# Altium schematic sheet MCU.SchDoc
size A4; SheetNumber: 2; SheetTotal: 6
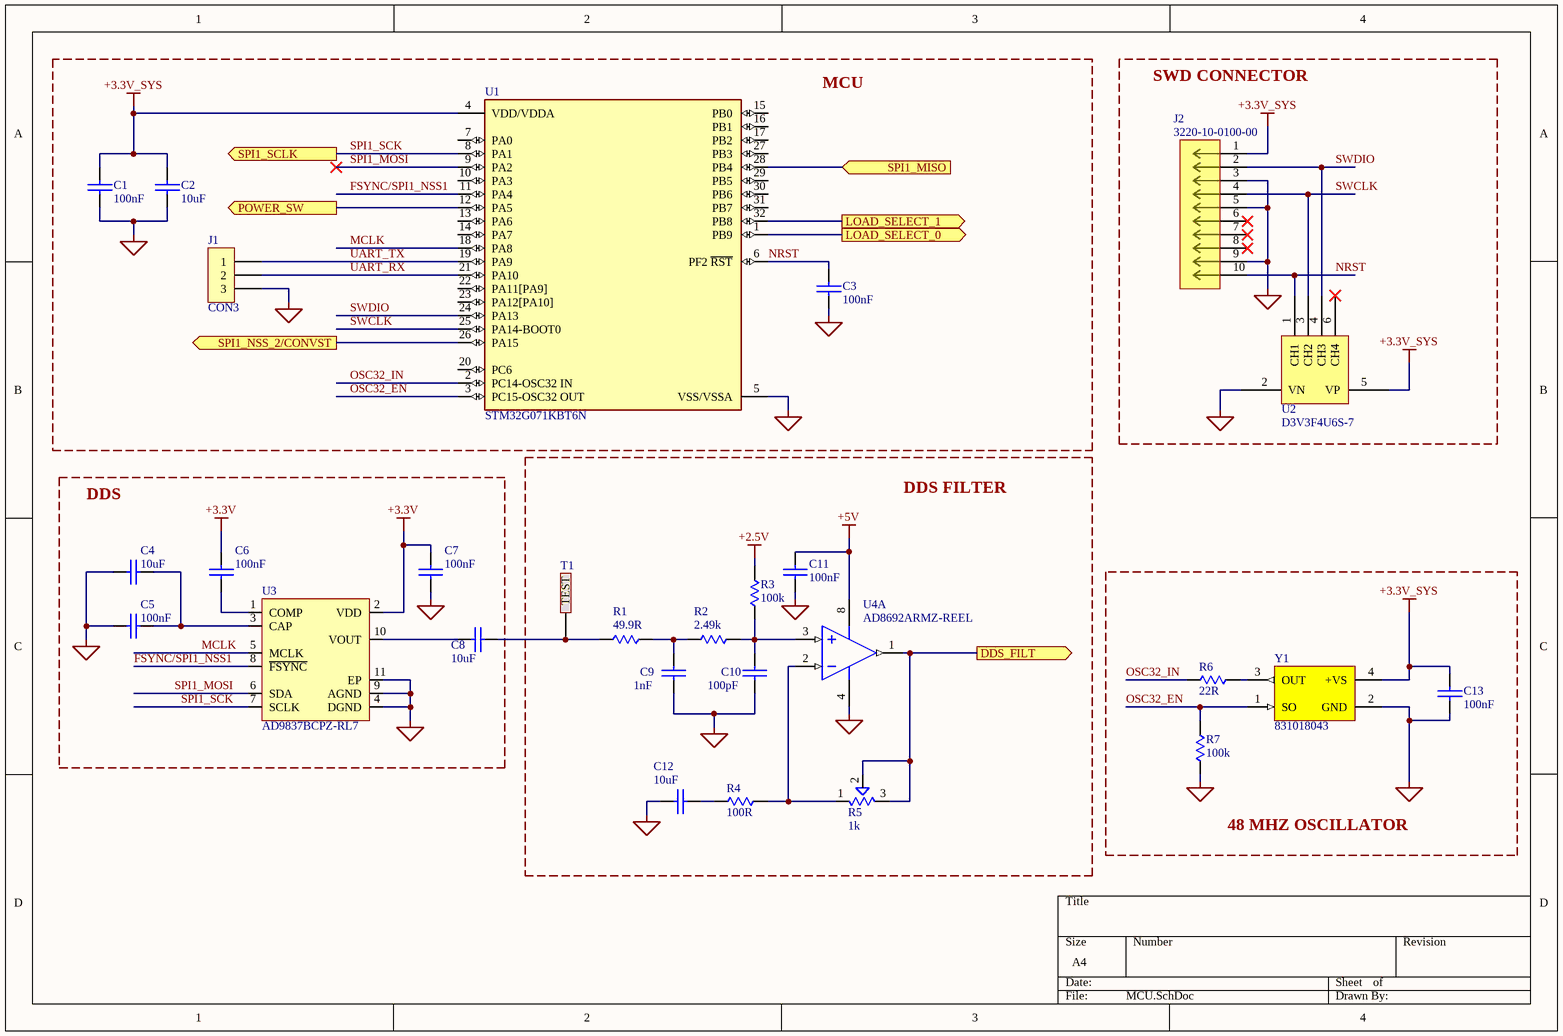
[diagram p0: MCU.SchDoc]

## Parts
C1  100nF  [0603-CAP]
C2  10uF  [0603-CAP]
C3  100nF  [0603-CAP]
C4  10uF  [0603-CAP]
C5  100nF  [0603-CAP]
C6  100nF  [0603-CAP]
C7  100nF  [0603-CAP]
C8  10uF  [0603-CAP]
C9  1nF  [0603-CAP]
C10  100pF  [0603-CAP]
C11  100nF  [0603-CAP]
C12  10uF  [0603-CAP]
C13  100nF  [0603-CAP]
J1  CON3  [SIP3]
J2  3220-10-0100-00  [CONN_3220-10-0100-00_CNC]
R1  49.9R  [0603-RES]
R2  2.49k  [0603-RES]
R3  100k  [0603-RES]
R4  100R  [0603-RES]
R5  1k  [TRIM_PVG5A102C03R00]
R6  22R  [0603-RES]
R7  100k  [0603-RES]
T1  5002K  [TESTPOINT White]  (value not drawn)
U1  STM32G071KBT6N  [FP-LQFP32-5V-IPC_C]
U2  D3V3F4U6S-7  [SOT-363_DIO]
U3  AD9837BCPZ-RL7  [LFCSP-WD (3x3) - 10 Pin EPAD]
U4  AD8692ARMZ-REEL  [ADI-RM-8_M]  (part A of 2)
Y1  831018043  [WE-SPXO_CFPS-73]

## Blocks framed on the sheet
MCU: C1-C3 J1 U1
SWD CONNECTOR: J2 U2
DDS FILTER: C9-C12 R1-R5 T1 U4
DDS: C4-C8 U3
48 MHZ OSCILLATOR: C13 R6 R7 Y1

## Ports
DDS_FILT (out, see BLOCK DIAGRAM[2B], MEHCP[1A]), LOAD_SELECT_0 (out, see BLOCK DIAGRAM[2B], LOADS[3C]), LOAD_SELECT_1 (out, see BLOCK DIAGRAM[2B], LOADS[4C]), POWER_SW (out, see BLOCK DIAGRAM[2B], POWER[3C]), SPI1_MISO (in, see BLOCK DIAGRAM[2B], SENSE[3D]), SPI1_NSS_2/CONVST (out, see BLOCK DIAGRAM[2B], SENSE[3D]), SPI1_SCLK (out, see BLOCK DIAGRAM[2B], SENSE[3D])

## Nets
+2.5V: R3.2
+3.3V: C6.1 C7.1 U3.2(VDD)
+3.3V_SYS: C1.2 C2.1 C13.2 J2.1 U1.4(VDD/VDDA) U2.5(VP) Y1.4(+VS)
+5V: C11.1 U4.8(+V)
GND: C1.1 C2.2 C3.1 C4.2 C5.2 C7.2 C9.2 C10.2 C11.2 C12.2 C13.1 J1.3 J2.3 J2.5 J2.9 R7.1 U1.5(VSS/VSSA) U2.2(VN) U3.4(DGND) U3.9(AGND) U3.11(EP) U4.4(-V) Y1.2(GND)
DDS_FILT: R5.2 R5.3 U4.1(OUT_A) ; port DDS_FILT
FSYNC/SPI1_NSS1: U1.11(PA4) U3.8(~{FSYNC})
LOAD_SELECT_0: U1.1(PB9) ; port LOAD_SELECT_0
LOAD_SELECT_1: U1.32(PB8) ; port LOAD_SELECT_1
MCLK: U1.18(PA8) U3.5(MCLK)
NRST: C3.2 J2.10 U1.6(PF2_~{RST}) U2.1(CH1)
OSC32_EN: R7.2 U1.3(PC15-OSC32_OUT) Y1.1(SO)
OSC32_IN: R6.1 U1.2(PC14-OSC32_IN)
POWER_SW: U1.12(PA5) ; port POWER_SW
SPI1_MISO: U1.28(PB4) ; port SPI1_MISO
SPI1_MOSI: U1.9(PA2) U3.6(SDA)
SPI1_NSS_2/CONVST: U1.26(PA15) ; port SPI1_NSS_2/CONVST
SPI1_SCK: U1.8(PA1) U3.7(SCLK) ; port SPI1_SCLK
SWCLK: J2.4 U1.25(PA14-BOOT0) U2.3(CH2)
SWDIO: J2.2 U1.24(PA13) U2.4(CH3)
UART_RX: J1.2 U1.21(PA10)
UART_TX: J1.1 U1.19(PA9)
NetC4_1: C4.1 C5.1 U3.3(CAP)
NetC6_2: C6.2 U3.1(COMP)
NetC8_1: C8.1 R1.1 T1.1(TEST)
NetC8_2: C8.2 U3.10(VOUT)
NetC9_1: C9.1 R1.2 R2.1
NetC10_1: C10.1 R2.2 R3.1 U4.3(+IN_A)
NetC12_1: C12.1 R4.1
NetR4_2: R4.2 R5.1 U4.2(-IN_A)
NetR6_2: R6.2 Y1.3(OUT)

Not connected (* = marked no-connect by the designer): J2 6* 7* 8*; U1 7(PA0) 10(PA3) 13(PA6) 14(PA7) 15(PB0) 16(PB1) 17(PB2) 20(PC6) 22(PA11[PA9]) 23(PA12[PA10]) 27(PB3) 29(PB5) 30(PB6) 31(PB7); U2 6(CH4)*

## Library data of the parts
C1 C3 C5-C7 C11 C13 = CGA3E2C0G1H472J080AA: CAP CER 100 NF 50V X7R 0603; Manufacturer Part Number 1: CC0603KRX7R9BB104; Manufacturer 1: YAGEO; Tech#: SMT; Detailed Description: CAP CER 100 NF 50V X7R 0603; Supplier 1: DigiKey; Supplier Part Number 1: 311-1344-1-ND; Supplier 2: Mouser; Supplier Part Number 2: 810-CGA3E2C0G1H472J; Price(100): 0.1434; Price(250): 0.10756
C2 C4 C8 C12 = CGA3E2C0G1H472J080AA: CAP CER 10uF 6.3V X5R 0603; Manufacturer Part Number 1: GRM188R60J106KE47D; Manufacturer 1: Murata Electronics; Detailed Description: CAP CER 100 NF 50V X7R 0603; Tech#: SMT; Supplier 1: DigiKey; Supplier Part Number 1: 490-12538-1-ND; Supplier 2: Mouser; Supplier Part Number 2: 810-CGA3E2C0G1H472J; Price(100): 0.1434; Price(250): 0.10756
C9 = CGA3E2C0G1H472J080AA: CAP CER 1000 PF 50V C0G 0603; Manufacturer Part Number 1: GRM1885C1H102JA01D; Manufacturer 1: Murata; Detailed Description: CAP CER 100 NF 50V X7R 0603; Tech#: SMT; Supplier 1: DigiKey; Supplier Part Number 1: 490-1451-1-ND; Supplier 2: Mouser; Supplier Part Number 2: 810-CGA3E2C0G1H472J; Price(100): 0.1434; Price(250): 0.10756
C10 = CGA3E2C0G1H472J080AA: CAP CER 100 PF 50V C0G 0603; Manufacturer Part Number 1: CC0603JRNPO9BN101; Manufacturer 1: YAGEO; Tech#: SMT; Detailed Description: CAP CER 100 PF 50V C0G 0603; Supplier 1: DigiKey; Supplier Part Number 1: 311-1069-1-ND; Supplier 2: Mouser; Supplier Part Number 2: 810-CGA3E2C0G1H472J; Price(100): 0.1434; Price(250): 0.10756
J1 = CON3: Connector
J2 = 3220-10-0100-00: Description; Manufacturer_Name: CNC Tech; Copyright: Copyright (C) 2025 Ultra Librarian. All rights reserved.; Manufacturer_Part_Number: 3220-10-0100-00; RefDes: RefDes; Type: Type
R1 = 4.99K 0603: RES SMD 49.9OHM 0.1% 1/10W 0603; Manufacturer Part Number 1: RT0603BRD0749R9L; Manufacturer 1: Yageo; Tech#: SMT; Detailed Description: RES SMD 49.9OHM 0.1% 1/10W 0603; Supplier 1: DigiKey; Supplier Part Number 1: YAG1672CT-ND; Supplier 2: Mouser; Supplier Part Number 2: 754-RR0816P-4991D68H; Price(100): 0.023
R2 = 4.99K 0603: RES SMD 2.49kOHM 0.1% 1/10W 0603; Manufacturer Part Number 1: ERA-3AEB2491V; Manufacturer 1: Panasonic; Tech#: SMT; Detailed Description: RES SMD 2.49kOHM 0.1% 1/10W 0603; Supplier 1: DigiKey; Supplier Part Number 1: RES SMD 2.49KOHM 0.1% 1/10W 0603; Supplier 2: Mouser; Supplier Part Number 2: 754-RR0816P-4991D68H; Price(100): 0.023
R3 R7 = 4.99K 0603: RES SMD 100KOHM 0.1% 1/10W 0603; Manufacturer Part Number 1: RT0603BRD07100KL; Manufacturer 1: YAGEO; Detailed Description: RES SMD 4.99KOHM 0.5% 1/16W 0603; Tech#: SMT; Supplier 1: DigiKey; Supplier Part Number 1: YAG1235CT-ND; Supplier 2: Mouser; Supplier Part Number 2: 754-RR0816P-4991D68H; Price(100): 0.023
R4 = 4.99K 0603: RES SMD 100OHM 0.1% 1/10W 0603; Manufacturer Part Number 1: RG1608P-101-B-T5; Manufacturer 1: Susumu; Detailed Description: RES SMD 4.99KOHM 0.5% 1/16W 0603; Tech#: SMT; Supplier 1: DigiKey; Supplier Part Number 1: RR08P4.99KDCT-ND; Supplier 2: Mouser; Supplier Part Number 2: 754-RR0816P-4991D68H; Price(100): 0.023
R5 = PVG5A102C03R00: TRIMMER-SMD 4MM SQ MT CERMET Square / 12 turn / Sealed | Bourns PVG5A102C03R00; SnapEDA_Link: https://www.snapeda.com/parts/PVG5A102C03R00/Bourns/view-part/?ref=snap; Package: SMD-3 Bourns; Value: *; MF: Bourns; MP: PVG5A102C03R00; Check_prices: https://www.snapeda.com/parts/PVG5A102C03R00/Bourns/view-part/?ref=eda
R6 = 4.99K 0603: RES SMD 22OHM 0.1% 1/10W 0603; Manufacturer Part Number 1: RT0603BRD0722RL; Manufacturer 1: YAGEO; Tech#: SMT; Detailed Description: RES SMD 22OHM 0.1% 1/10W 0603; Supplier 1: DigiKey; Supplier Part Number 1: 13-RT0603BRD0722RLCT-ND; Supplier 2: Mouser; Supplier Part Number 2: 754-RR0816P-4991D68H; Price(100): 0.023
T1 = 5002K: PC TEST POINT MINIATURE WHITE; Manufacturer 1: Keystone Electronics; Detailed Description: Connector, TestPoint White; Location: F1-33; Tech#: T/H; Manufacturer Part Number 1: 5002K; Supplier 1: DigiKey; Supplier Part Number 1: 36-5002-ND; Supplier 2: Mouser; Supplier Part Number 2: 534-5002; Price(1): 0.56; Price(10): 0.506; Price(100): 0.3541
U1 = CMP-12105-000115-1: IC MCU 32BIT 128KB FLASH 32LQFP; Core Architecture: ARM; Frequency: 64MHz; Number of I/Os: 30; Interface: I2C; Oscillator Type: Internal; Peripherals: Brown-out Detect/Reset; Number of Pins: 32; Max Operating Temperature: 85°C; RoHS Compliant: Yes; Packaging: Cut Tape; Case/Package: LQFP; Memory Type: FLASH; Memory Size: 128KB; Min Operating Temperature: -40°C
U2 = D3V3F4U6S-7: Description; Manufacturer_Name: Diodes Inc; Copyright: Copyright (C) 2025 Ultra Librarian. All rights reserved.; Manufacturer_Part_Number: D3V3F4U6S-7; RefDes: RefDes; Type: Type
U3 = AD9837BCPZ-RL7: Direct Digital Synthesis IC 10 b 16 MHz 28 b Tuning 10-LFCSP-WD (3x3)
U4 = CMP-0384-01747-1: Double Channel Wide Bandwidth Operational Amplifier, 10 MHz BW, 5 V/us SR, Industrial, 8-pin SOP (RM-8), Reel; Manufacturer: Analog Devices; Generic Part Number: AD8692; Slew Rate: 5V/us; Automotive Qualified: Yes; V Span Max: 6V; V Span Min: 2.7V; Input Bias Current: 200fA; Amplifiers Per Package: 2; Iq/Amp: 1.05mA; Input Offset Voltage: 400uV; Small Signal Bandwidth: 10MHz; ComponentLink1Description: Manufacturer URL; ComponentLink1URL: http://www.analog.com/en/index.html; Mounting Technology: Surface Mount; PackageDescription: 8-Pin Mini Small Outline Package, Body 3 x 3 mm, Pitch 0.65 mm; PackageReference: RM-8; DatasheetVersion: Rev. E; PartNumber: AD8692ARMZ-REEL; ComponentLink2Description: Datasheet; ComponentLink3Description: Package Specification; ComponentLink2URL: http://www.analog.com/static/imported-files/data_sheets/AD8691_8692_8694.pdf; ComponentLink3URL: http://www.analog.com/static/imported-files/packages/PKG_PDF/MSOP%28RM%29/RM_8.pdf; Code_JEDEC: MO-187-AA
Y1 = WE-SPXO_CFPS-73: MF: {'manufacturer': u'W\xfcrth Elektronik'}; Package: None; Price: None; Value: *; MP: 831018043; Availability: Unavailable